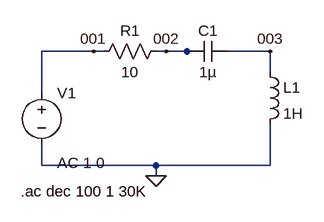
[diagram p0: schematic hw1_23.asc]
hw1_23.asc, the LTspice schematic file:
Version 4
SHEET 1 880 680
WIRE -336 -80 -416 -80
WIRE -320 -80 -336 -80
WIRE -224 -80 -240 -80
WIRE -192 -80 -224 -80
WIRE -176 -80 -192 -80
WIRE -64 -80 -128 -80
WIRE -64 -48 -64 -80
WIRE -416 -16 -416 -80
WIRE -416 96 -416 64
WIRE -240 96 -416 96
WIRE -64 96 -64 32
WIRE -64 96 -240 96
WIRE -240 112 -240 96
FLAG -240 112 0
FLAG -336 -80 001
FLAG -224 -80 002
FLAG -64 -80 003
SYMBOL voltage -416 -32 R0
WINDOW 123 24 124 Left 2
WINDOW 39 0 0 Left 0
SYMATTR Value2 AC 1 0
SYMATTR InstName V1
SYMATTR Value ""
SYMBOL res -224 -96 R90
WINDOW 0 0 56 VBottom 2
WINDOW 3 32 56 VTop 2
SYMATTR InstName R1
SYMATTR Value 10
SYMBOL cap -128 -96 R90
WINDOW 0 0 32 VBottom 2
WINDOW 3 32 32 VTop 2
SYMATTR InstName C1
SYMATTR Value 1µ
SYMBOL ind -80 -64 R0
SYMATTR InstName L1
SYMATTR Value 1H
TEXT -448 136 Left 2 !.ac dec 100 1 30K

The netlist it stands for:
* hw1_23.asc
V1 001 0 AC 1 0
R1 002 001 10
C1 003 002 1µ
L1 003 0 1H
.ac dec 100 1 30K
.backanno
.end

* Results of the author's LTspice run, read from the files saved beside the schematic
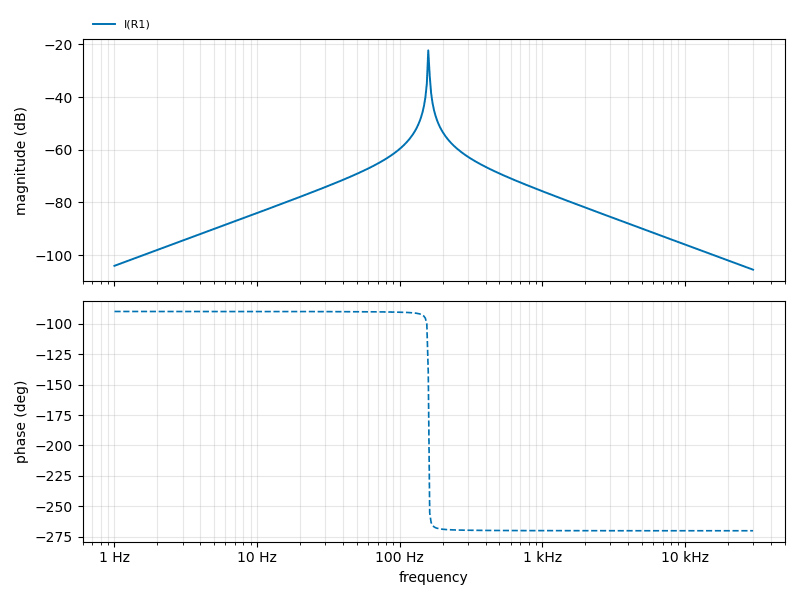
[diagram p1: AC Analysis of hw1_23.asc, plotted from the saved traces]
* AC Analysis, 1 run:
*   I(R1): -104.04 dB at 1 Hz, -105.51 dB at 30 kHz, peak -22.31 dB at 158.5 Hz, 3 dB below the peak at 157.6 Hz and 159.6 Hz